# Altium schematic sheet Plugs.SchDoc
size A4; SheetNumber: 4; SheetTotal: 4
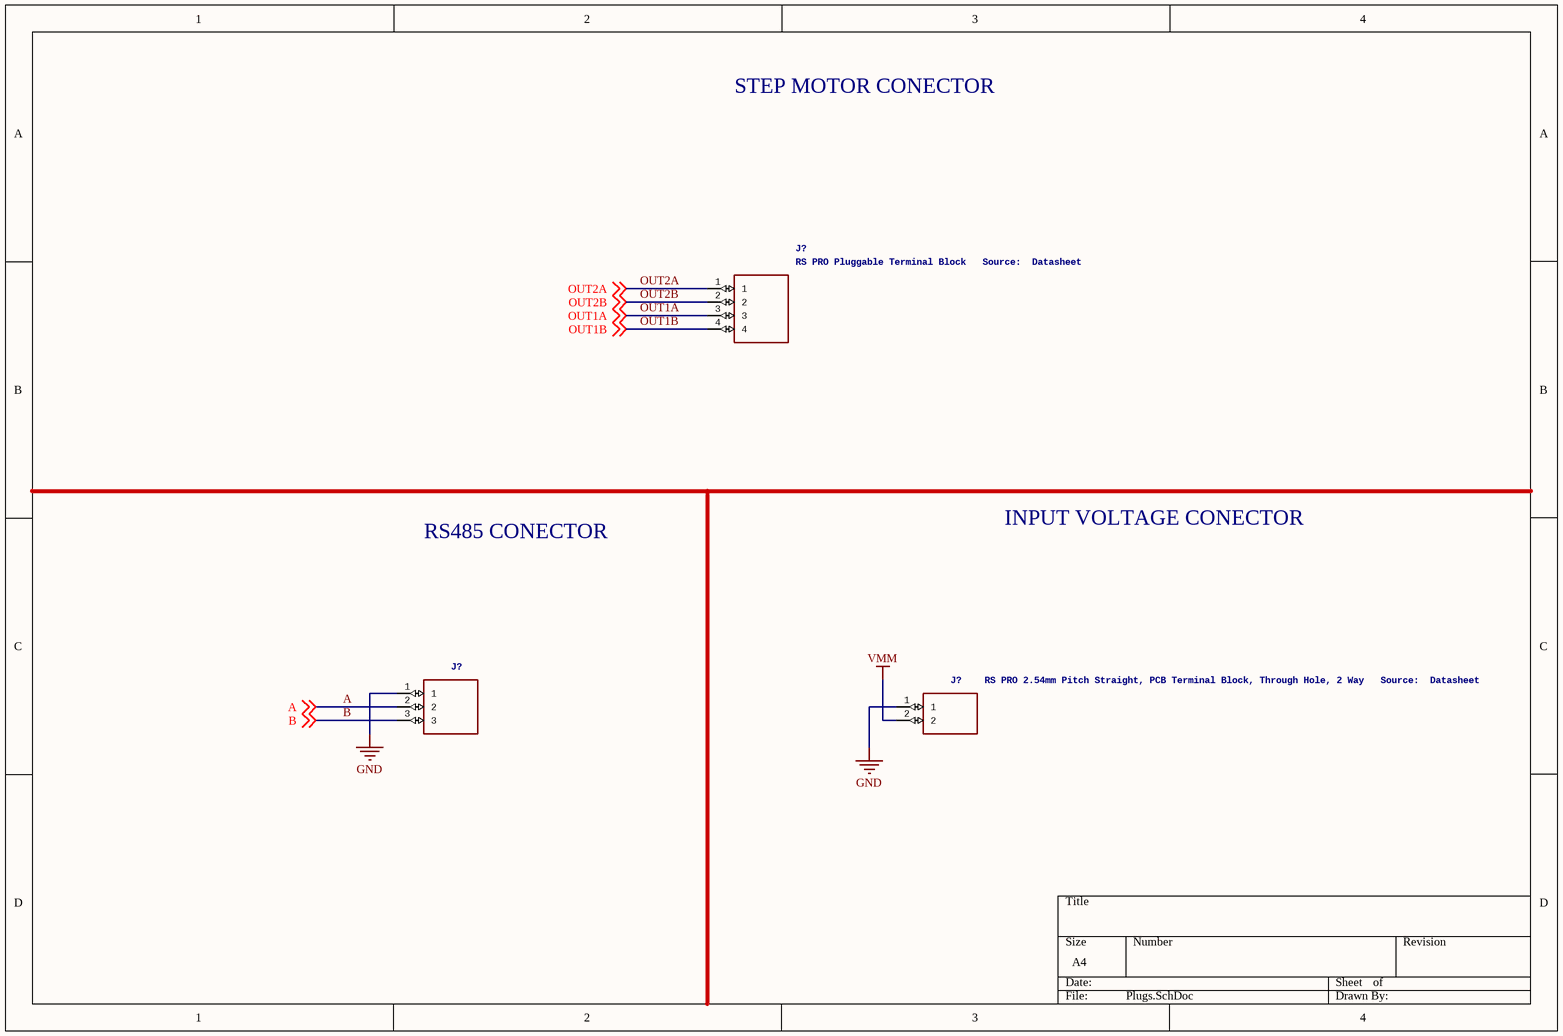
[diagram p0: Plugs.SchDoc]

## Parts
(Parts that share a designator on the sheet are numbered #1, #2 ... from top to bottom, then left to right.)
J?#1  RS PRO Pluggable Terminal Block   Source:  Datasheet  [CTBP20544]
J?#2  RS PRO 2.54mm Pitch Straight, PCB Terminal Block, Through Hole, 3 Way   Source:  Datasheet  [MB31225403NIP]  (value not drawn)
J?#3  RS PRO 2.54mm Pitch Straight, PCB Terminal Block, Through Hole, 2 Way   Source:  Datasheet  [MB31225402NIP]

## Nets
GND: J?#2.1 J?#3.1
VMM: J?#3.2
A: J?#2.2 ; off-sheet A
B: J?#2.3 ; off-sheet B
OUT1A: J?#1.3 ; off-sheet OUT1A
OUT1B: J?#1.4 ; off-sheet OUT1B
OUT2A: J?#1.1 ; off-sheet OUT2A
OUT2B: J?#1.2 ; off-sheet OUT2B

## Notes on the sheet
- STEP MOTOR CONECTOR
- RS485 CONECTOR
- INPUT VOLTAGE CONECTOR

## Library data of the parts
J?#1 = CTBP2054_4: Manufacturer_Name: RS Components; Manufacturer_Part_Number: CTBP2054/4; GateName_1: G$1; SymbolName_1: CTBP2054_4; LibraryName: CTBP2054_4; DeviceSetName: CTBP2054_4; RS_Part_Number: 1731623; RS_Price-Stock: https://uk.rs-online.com/web/p/products/1731623; Height: 8.5mm
J?#2 = MB312-25403NIP: Manufacturer_Name: RS Components; GateName_1: G$1; SymbolName_1: MB312-25403NIP; LibraryName: MB312-25403NIP; DeviceSetName: MB312-25403NIP; RS_Part_Number: 7901092; RS_Price-Stock: https://uk.rs-online.com/web/p/products/7901092; Manufacturer_Part_Number: MB312-25403NIP; Height: 8.8mm
J?#3 = MB312-25402NIP: Manufacturer_Name: RS Components; GateName_1: G$1; SymbolName_1: MB312-25402NIP; LibraryName: MB312-25402NIP; DeviceSetName: MB312-25402NIP; RS_Part_Number: 7901098; RS_Price-Stock: https://uk.rs-online.com/web/p/products/7901098; Manufacturer_Part_Number: MB312-25402NIP; Height: 8.8mm